# Altium project ZLS-018 Rev 5.PrjPcb
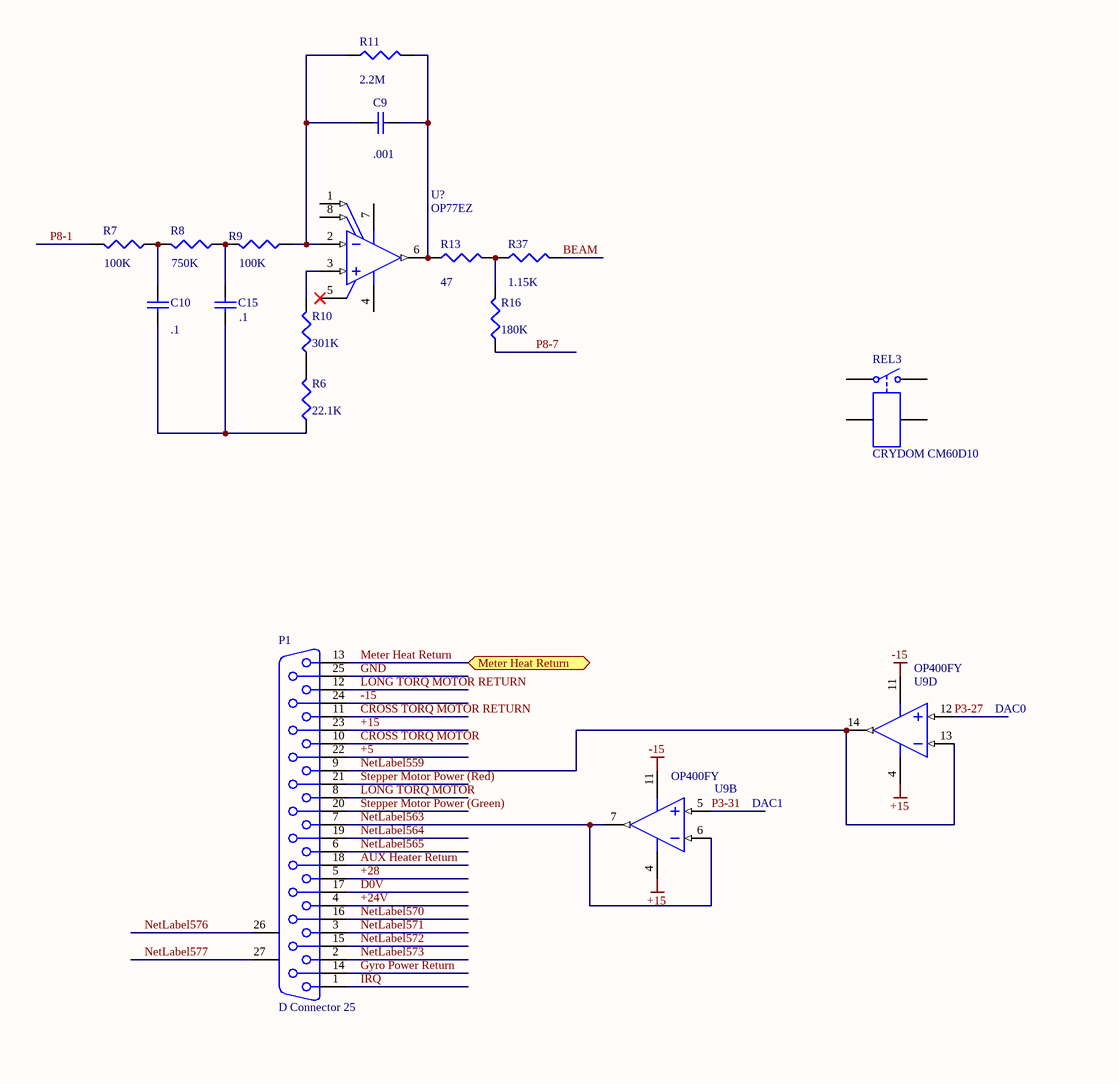
[diagram p0: ZLS-018 Rev 5.SchDoc, top left]
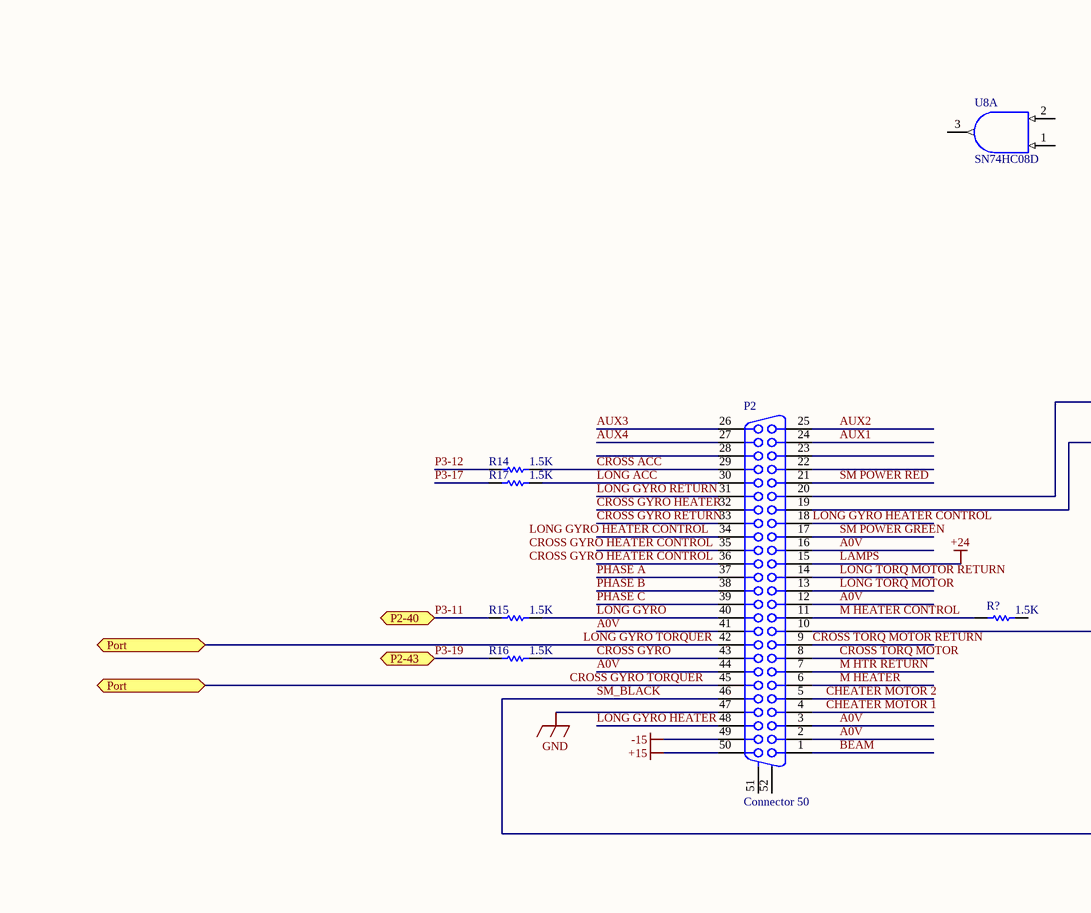
[diagram p1: ZLS-018 Rev 5.SchDoc, bottom left]
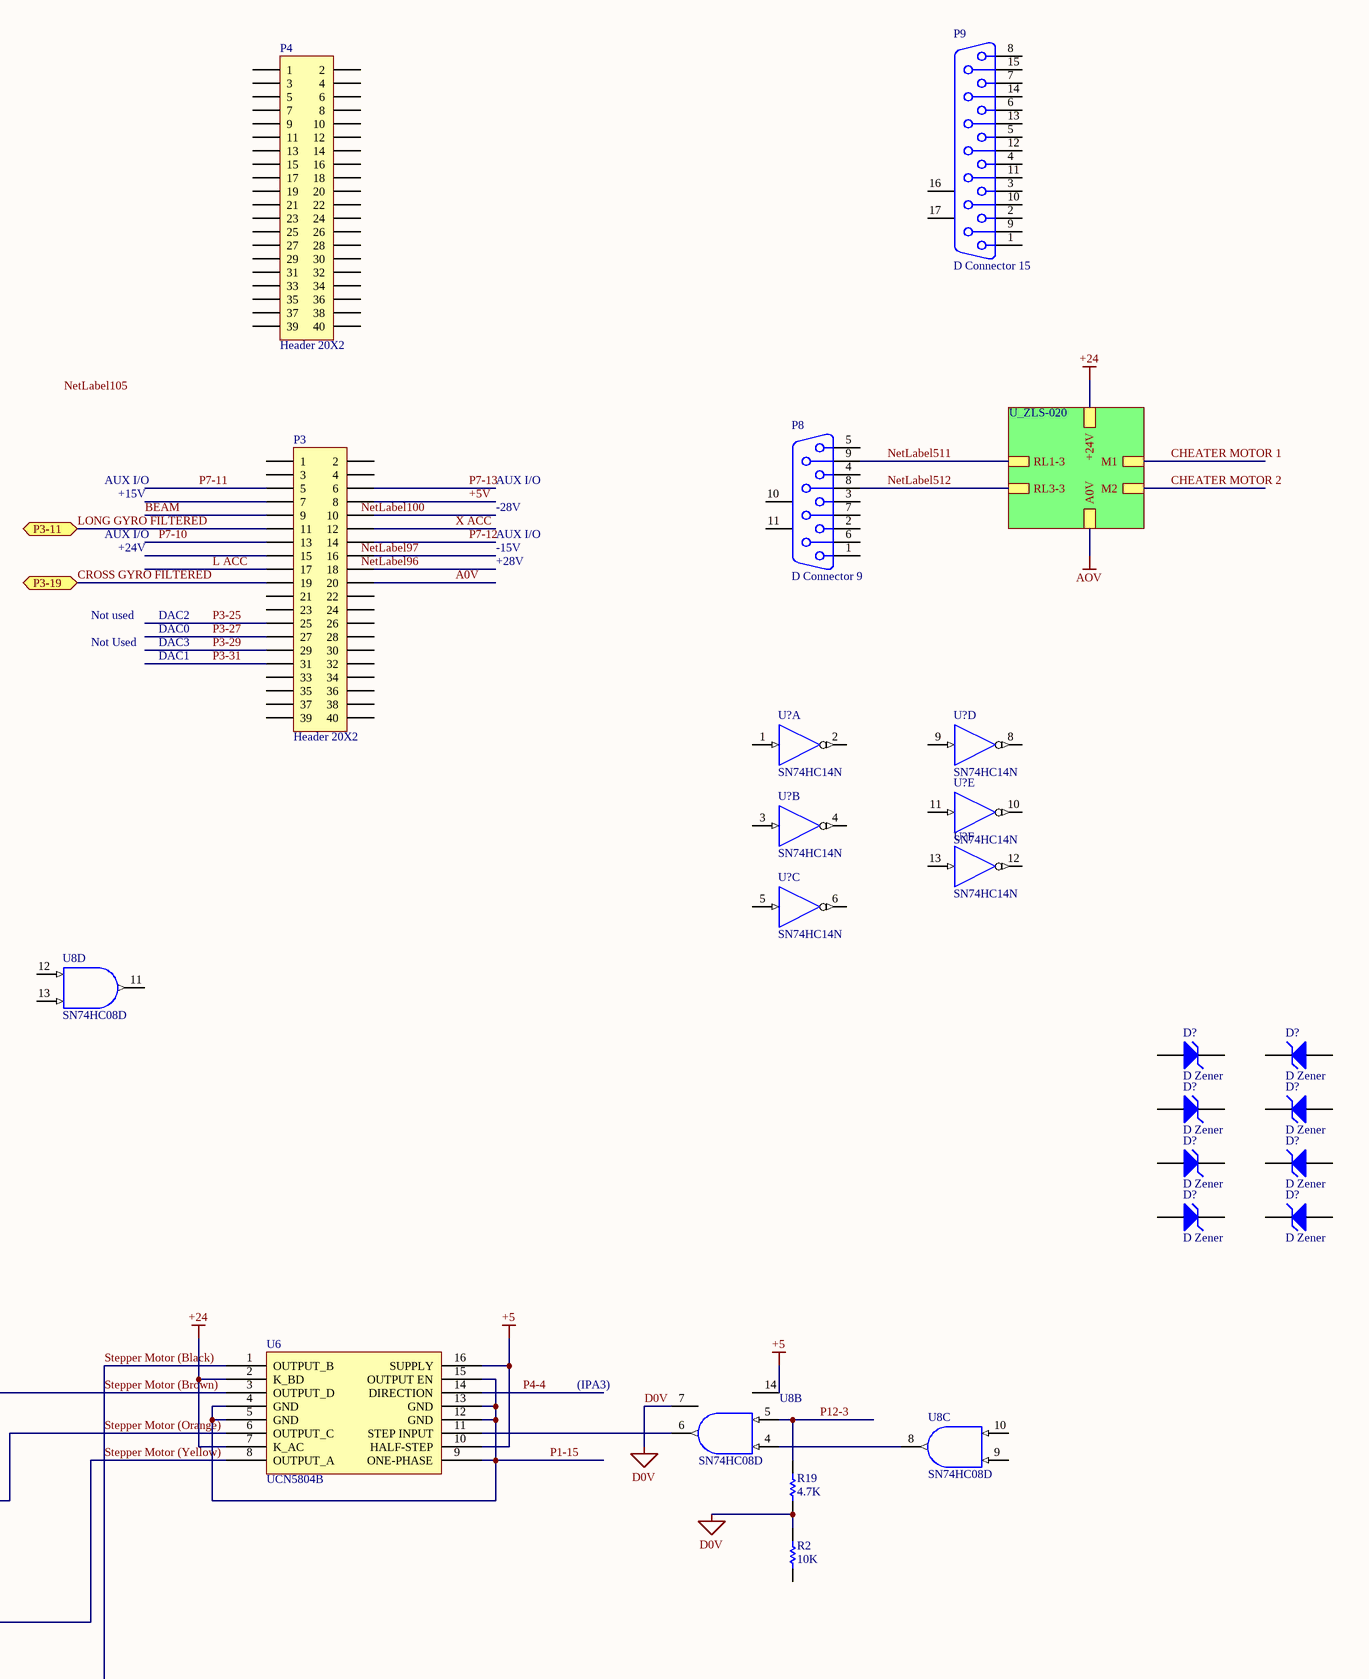
[diagram p2: ZLS-018 Rev 5.SchDoc, bottom right]
6 sheets, 75 parts. Net scope: hierarchical (ports join the sheet entries above them; power ports are global).
Sheets:
  ZLS-018 Rev 5.SchDoc
    U_ZLS-020 = ZLS-020.SchDoc
  ZLS-017.SchDoc
  ZLS-026.SchDoc
  Antialiasing Filter.SchDoc
  Cheater Motor Driver.SchDoc

## Sheet ZLS-018 Rev 5.SchDoc
size OrCAD C

### Parts
(Parts that share a designator on the sheet are numbered #1, #2 ... from top to bottom, then left to right.)
C9  value .001  [RAD-0.3]  (hidden comment: Cap)
C10  value .1  [RAD-0.3]  (hidden comment: Cap)
C15  value .1  [RAD-0.3]  (hidden comment: Cap)
D?#1  D Zener  [DIODE-0.7]
D?#2  D Zener  [DIODE-0.7]
D?#3  D Zener  [DIODE-0.7]
D?#4  D Zener  [DIODE-0.7]
D?#5  D Zener  [DIODE-0.7]
D?#6  D Zener  [DIODE-0.7]
D?#7  D Zener  [DIODE-0.7]
D?#8  D Zener  [DIODE-0.7]
P1  D Connector 25  [DSUB1.385-2H25A]
P2  Connector 50  [CHAMP1.27-2H50]
P3  Header 20X2  [HDR2X20]
P4  Header 20X2  [HDR2X20]
P8  D Connector 9  [DSUB1.385-2H9]
P9  D Connector 15  [DSUB1.385-2H15]
R2  value 10K  [AXIAL-0.3]  (hidden comment: Res1)
R6  value 22.1K  [J1-0603]  (hidden comment: Res3)
R7  value 100K  [J1-0603]  (hidden comment: Res3)
R8  value 750K  [J1-0603]  (hidden comment: Res3)
R9  value 100K  [J1-0603]  (hidden comment: Res3)
R10  value 301K  [J1-0603]  (hidden comment: Res3)
R11  value 2.2M  [J1-0603]  (hidden comment: Res3)
R13  value 47  [J1-0603]  (hidden comment: Res3)
R14  value 1.5K  [AXIAL-0.3]  (hidden comment: Res1)
R15  value 1.5K  [AXIAL-0.3]  (hidden comment: Res1)
R16#1  value 180K  [J1-0603]  (hidden comment: Res3)
R16#2  value 1.5K  [AXIAL-0.3]  (hidden comment: Res1)
R17  value 1.5K  [AXIAL-0.3]  (hidden comment: Res1)
R19#1  value 4.7K  [AXIAL-0.3]  (hidden comment: Res1)
R37  value 1.15K  [J1-0603]  (hidden comment: Res3)
R?#1  value 1.5K  [AXIAL-0.3]  (hidden comment: Res1)
REL3#1  CRYDOM CM60D10  [MODULE4]
U6  UCN5804B
U8  SN74HC08D  [D014_N]  (parts A,B,C,D of 4)
U9  OP400FY  [ADI-Q-14]  (parts B,D of 4)
U?#1  OP77EZ  [ADI-Q-8]
U?#2  SN74HC14N  [N014]  (part A of 6)
U?#3  SN74HC14N  [N014]  (part D of 6)
U?#4  SN74HC14N  [N014]  (part E of 6)
U?#5  SN74HC14N  [N014]  (part B of 6)
U?#6  SN74HC14N  [N014]  (part F of 6)
U?#7  SN74HC14N  [N014]  (part C of 6)

### Sub-sheets
U_ZLS-020 = ZLS-020.SchDoc: +24V, RL1-3, RL3-3, A0V, M2, M1

### Ports
Meter Heat Return, P2-40, P2-43, P3-11, P3-19, Port

### Nets
+5: P1.22 U6.10(HALF-STEP) U6.16(SUPPLY) U8.14(VCC) U?#2.14(VCC) U?#3.14(VCC) U?#4.14(VCC) U?#5.14(VCC) U?#6.14(VCC) U?#7.14(VCC)  [also labelled VCC]
+15: P1.23 P2.50 U9.4(+V)
-15: P1.24 P2.49 U9.11(-V)
D0V: P1.17 P1.25 P2.47 R2.2 R19#1.1 U8.7(GND) U?#2.7(GND) U?#3.7(GND) U?#4.7(GND) U?#5.7(GND) U?#6.7(GND) U?#7.7(GND)  [also labelled GND]
LAMPS: P2.15 U6.2(K_BD) U6.7(K_AC) ; sheet U_ZLS-020/+24V  [also labelled +24]
+5V: P3.8
+24V: P1.4
+28: P1.5
A0V: P2.2 P2.3 P2.12 P2.16 P2.41 P2.44 P3.20
AUX1: P2.24
AUX2: P2.25
AUX3: P2.26
AUX4: P2.27
AUX Heater Return: P1.18
BEAM: P2.1 P3.9 R37.2
CHEATER MOTOR 1: P2.4 ; sheet U_ZLS-020/M1
CHEATER MOTOR 2: P2.5 ; sheet U_ZLS-020/M2
CROSS ACC: P2.29 R14.2
CROSS GYRO: P2.43 R16#2.2
CROSS GYRO FILTERED: P3.19 ; port P3-19
CROSS GYRO HEATER: P2.32
CROSS GYRO RETURN: P2.33
CROSS GYRO TORQUER: P2.42 P2.45 ; port Port  [also labelled LONG GYRO TORQUER]
CROSS TORQ MOTOR: P1.10 P2.8
CROSS TORQ MOTOR RETURN: P1.11 P2.9
Gyro Power Return: P1.14
IRQ: P1.1
L ACC: P3.17
LONG ACC: P2.30 R17.2
LONG GYRO: P2.40 R15.2
LONG GYRO FILTERED: P3.11 ; port P3-11
LONG GYRO HEATER: P2.48
LONG GYRO HEATER CONTROL: P2.18
LONG GYRO RETURN: P2.31
LONG TORQ MOTOR: P1.8 P2.13
LONG TORQ MOTOR RETURN: P1.12 P2.14
M HEATER: P2.6
M HEATER CONTROL: P2.11 R?#1.1
M HTR RETURN: P2.7
Meter Heat Return: P1.13 ; port Meter Heat Return
NetLabel511: P8.9 ; sheet U_ZLS-020/RL1-3
NetLabel512: P8.8 ; sheet U_ZLS-020/RL3-3
NetLabel559: P1.9 U9.13(-IN_D) U9.14(OUT_D)
NetLabel563: P1.7 U9.6(-IN_B) U9.7(OUT_B)
NetLabel564: P1.19
NetLabel565: P1.6
NetLabel570: P1.16
NetLabel571: P1.3
NetLabel572: P1.15
NetLabel573: P1.2
NetLabel576: P1.26(MH1)
NetLabel577: P1.27(MH2)
P1-15: U6.4(GND) U6.5(GND) U6.9(ONE-PHASE) U6.12(GND) U6.13(GND) U6.15(OUTPUT_EN)
P3-11: R15.1 ; port P2-40
P3-12: R14.1
P3-17: R17.1
P3-19: R16#2.1 ; port P2-43
P3-25: P3.25
P3-27: P3.27 U9.12(+IN_D)
P3-29: P3.29
P3-31: P3.31 U9.5(+IN_B)
P4-4: U6.14(DIRECTION)
P7-10: P3.13
P7-11: P3.5
P7-12: P3.14
P7-13: P3.6
P8-1: R7.2
P8-7: R16#1.1
P12-3: R19#1.2 U8.5(B)
PHASE A: P2.37
PHASE B: P2.38
PHASE C: P2.39
SM POWER GREEN: P2.17
SM POWER RED: P2.21
SM_BLACK: P2.10 P2.19 P2.20 P2.46 U6.1(OUTPUT_B) U6.3(OUTPUT_D) U6.6(OUTPUT_C) U6.8(OUTPUT_A)  [also labelled Stepper Motor (Black), Stepper Motor (Brown), Stepper Motor (Orange), Stepper Motor (Yellow)]
Stepper Motor Power (Green): P1.20
Stepper Motor Power (Red): P1.21
X ACC: P3.12
NetC9_1: C9.1 R9.1 R11.1 U?#1.2(-IN)
NetC9_2: C9.2 R11.2 R13.1 U?#1.6(OUT)
NetC10_1: C10.1 C15.1 R6.1
NetC10_2: C10.2 R7.1 R8.2
NetC15_2: C15.2 R8.1 R9.2
NetR6_2: R6.2 R10.1
NetR10_2: R10.2 U?#1.3(+IN)
NetR13_2: R13.2 R16#1.2 R37.1
NetU6_11: U6.11(STEP_INPUT) U8.6(Y)
NetU8_4: U8.4(A) U8.8(Y)

Not connected (* = marked no-connect by the designer): D?#1 1(A) 2(K); D?#2 1(A) 2(K); D?#3 1(A) 2(K); D?#4 1(A) 2(K); D?#5 1(A) 2(K); D?#6 1(A) 2(K); D?#7 1(A) 2(K); D?#8 1(A) 2(K); P2 22 23 28 34 35 36 51(MH1) 52(MH2); P3 1 2 3 4 7 10 15 16 18 21 22 23 24 26 28 30 32 33 34 35 36 37 38 39 40; P4 1 2 3 4 5 6 7 8 9 10 11 12 13 14 15 16 17 18 19 20 21 22 23 24 25 26 27 28 29 30 31 32 33 34 35 36 37 38 39 40; P8 1 2 3 4 5 6 7 10(MH1) 11(MH2); P9 1 2 3 4 5 6 7 8 9 10 11 12 13 14 15 16(MH1) 17(MH2); R2 1; R?#1 2; REL3#1 1 2 3 4; U8 1(A) 2(B) 3(Y) 9(A) 10(B) 11(Y) 12(A) 13(B); U?#1 1(VOS_TRIM) 4(V-) 5(NC)* 7(V+) 8(VOS_TRIM); U?#2 1(A) 2(Y); U?#3 8(Y) 9(A); U?#4 10(Y) 11(A); U?#5 3(A) 4(Y); U?#6 12(Y) 13(A); U?#7 5(A) 6(Y)

### Notes on the sheet
- AUX I/O
- +15V
- -28V
- DAC0
- +24V
- +28V
- -15V
- DAC1
- Not used
- Not Used
- DAC3
- DAC2
- (IPA3)
- Labels drawn without touching a wire or pin: CROSS GYRO HEATER CONTROL, LONG GYRO HEATER CONTROL, NetLabel96, NetLabel97, NetLabel100, NetLabel105
- Title
- Size:
- Date:
- File:
- Orcad C
- Number:
- Time:
- Revision:
- Sheet
- of

### Library data of the parts
C9 C10 C15 = Cap: Capacitor; Published: 8-Jun-2000; LatestRevisionDate: 17-Jul-2002; LatestRevisionNote: Re-released for DXP Platform.; PackageReference: RAD-0.3; Publisher: Altium Limited; PackageDescription: Radial Cap, Thru-Hole; 2 Leads; 0.3 in Pin Spacing
D?#1-D?#8 = D Zener: Zener Diode; Published: 8-Jun-2000; LatestRevisionDate: 17-Jul-2002; LatestRevisionNote: Re-released for DXP Platform.; PackageReference: DIODE-0.7; Publisher: Altium Limited; PackageDescription: Diode, Thru-Hole; 2 Leads; 0.7 in Pin Spacing
P1 = D Connector 25: Receptacle Assembly, 25 Position, Right Angle; PackageDocument: U; Positions: 25; Published: 15-Jun-2001; LatestRevisionDate: 17-Jul-2002; LatestRevisionNote: Re-released for DXP Platform.; DatasheetDocument: 19-Mar-1999; PackageReference: 787202; Publisher: Altium Limited; Orientation: Right Angle; Gender: Receptacle
P2 = Connector 50: Receptacle Header Assemby; PackageDocument: B; Positions: 50; Published: 15-Jun-2001; LatestRevisionDate: 17-Jul-2002; LatestRevisionNote: Re-released for DXP Platform.; DatasheetDocument: 1-Oct-1983; PackageReference: 178240-7; Publisher: Altium Limited; Orientation: Right Angle
P3 P4 = Header 20X2: Header, 20-Pin, Dual row; LatestRevisionDate: 17-Jul-2002; LatestRevisionNote: Re-released for DXP Platform.; Publisher: Altium Limited
P8 = D Connector 9: Receptacle Assembly, 9 Position, Right Angle; PackageDocument: O; Positions: 9; Published: 15-Jun-2001; LatestRevisionDate: 17-Jul-2002; LatestRevisionNote: Re-released for DXP Platform.; DatasheetDocument: 1-Sep-1999; PackageReference: 788750; Publisher: Altium Limited; Orientation: Right Angle; Gender: Receptacle
P9 = D Connector 15: Receptacle Assembly, 15 Position, Right Angle; PackageDocument: O; Positions: 15; Published: 15-Jun-2001; LatestRevisionDate: 17-Jul-2002; LatestRevisionNote: Re-released for DXP Platform.; DatasheetDocument: 1-Sep-99; PackageReference: 788757; Publisher: Altium Limited; Orientation: Right Angle; Gender: Receptacle
R2 R14 R15 R16#2 R17 R19#1 R?#1 = Res1: Resistor; Published: 8-Jun-2000; LatestRevisionDate: 17-Jul-2002; LatestRevisionNote: Re-released for DXP Platform.; PackageReference: AXIAL-0.3; Publisher: Altium Limited; PackageDescription: Axial Device, Thru-Hole; 2 Leads; 0.3 in Pin Spacing
R6-R11 R13 R16#1 R37 = Res3: Resistor; Published: 8-Jun-2000; LatestRevisionDate: 29-May-2009; LatestRevisionNote: IPC-7351 Footprint Added.; PackageReference: J1-0603; Publisher: Altium Limited; PackageDescription: Chip Resistor
REL3#1 = Relay-SPST: Single-Pole Single-Throw Relay; Published: 24-Mar-1999; LatestRevisionDate: 17-Jul-2002; LatestRevisionNote: Re-released for DXP Platform.; PackageReference: MODULE4; Publisher: Altium Limited
U8 = SN74HC08D: Quadruple 2-Input Positive-AND Gate; Published: 8-Jun-2000; LatestRevisionDate: 13-Apr-2006; LatestRevisionNote: IPC-7351 Footprint Added.; DatasheetVersion: May-1997; PackageVersion: Jan-1998; PackageReference: D014; Publisher: Altium Limited; PackageDescription: 14-Pin Small Outline Integrated Circuit 1.27 mm Pitch; Code_IPC: SOIC127P600-14; ComponentLink1Description: Manufacturer Link; ComponentLink1URL: http://www.ti.com/; ComponentLink2Description: Datasheet; ComponentLink2URL: http://www-s.ti.com/sc/ds/SN74HC08.pdf
U9 = CMP-0384-00277-1: Quad Channel Low Supply Current Operational Amplifier, 500 KHz BW, 150 mV/us SR, Industrial, 14-pin DIP (Q-14), Tube; Manufacturer: Analog Devices; Generic Part Number: OP400; Small Signal Bandwidth: 500KHz; Input Bias Current: 750pA; Input Offset Voltage: 80uV; Iq/Amp: 725uA; V Span Max: 40V; Amplifiers Per Package: 4; V Span Min: 6V; Packing: Tube; Mounting Technology: Through Hole; ComponentLink3Description: Package Specification; Slew Rate: 150mV/us; ComponentLink2Description: Datasheet; ComponentLink1Description: Manufacturer URL; ComponentLink1URL: http://www.analog.com/en/index.html; PackageDescription: 14-Pin Ceramic Dual In-Line Package, Row spacing 7.62 mm, Pitch 2.54 mm; ComponentLink2URL: http://www.analog.com/static/imported-files/data_sheets/OP400.pdf; DatasheetVersion: Rev. G; PackageReference: Q-14; PartNumber: OP400FY; ComponentLink3URL: http://www.analog.com/static/imported-files/packages/393665681442905251546090Q_14.pdf
U?#1 = CMP-0384-00323-1: Single Channel Ultra High Gain Operational Amplifier, 600 KHz BW, 300 mV/us SR, Industrial, 8-pin DIP (Q-8), Tube; Generic Part Number: OP77; Manufacturer: Analog Devices; Iq/Amp: 2mA; Small Signal Bandwidth: 600KHz; V Span Max: 44V; Input Bias Current: 1.2nA; Amplifiers Per Package: 1; Input Offset Voltage: 10uV; V Span Min: 6V; ComponentLink2Description: Datasheet; ComponentLink3URL: http://www.analog.com/static/imported-files/packages/3925655241313314758Q_8.pdf; PartNumber: OP77EZ; ComponentLink2URL: http://www.analog.com/static/imported-files/data_sheets/OP77.pdf; PackageDescription: 8-Pin Ceramic Dual In-Line Package, Row spacing 7.62 mm, Pitch 2.54 mm; PackageReference: Q-8; ComponentLink1Description: Manufacturer URL; Mounting Technology: Through Hole; ComponentLink3Description: Package Specification; ComponentLink1URL: http://www.analog.com/en/index.html; Slew Rate: 300mV/us; DatasheetVersion: Rev. E; Packing: Tube
U?#2-U?#7 = SN74HC14N: Hex Schmitt-Trigger Inverter; Published: 8-Jun-2000; LatestRevisionDate: 04-Mar-2005; LatestRevisionNote: Stylized 3D Model Added.; DatasheetVersion: May-1997; PackageVersion: Oct-1995; PackageReference: N014; Publisher: Altium Limited; PackageDescription: DIP; 14 Leads; Row Spacing 7.62 mm; Pitch 2.54 mm; ComponentLink1Description: Manufacturer Link; ComponentLink1URL: http://www.ti.com/; ComponentLink2Description: Datasheet; ComponentLink2URL: http://www-s.ti.com/sc/ds/sn74hc14.pdf

## Sheet ZLS-020.SchDoc: ZLS-020
size OrCAD A; Revision: 1; SheetNumber: 1; SheetTotal: 1; DocumentName: ZLS-020; ProjectName: ZLS-020
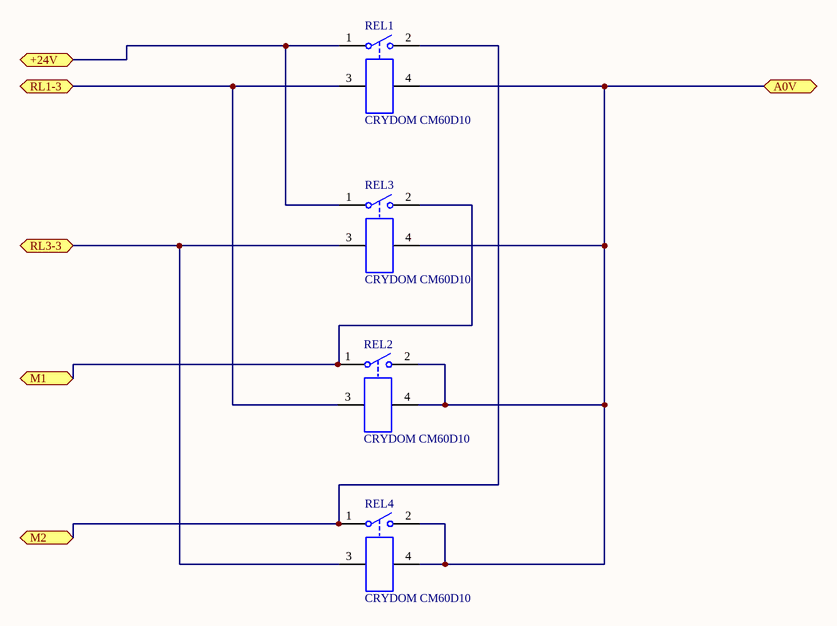
[diagram p3: ZLS-020.SchDoc]

### Parts
(Parts that share a designator on the sheet are numbered #1, #2 ... from top to bottom, then left to right.)
REL1  CRYDOM CM60D10  [MODULE4]
REL2  CRYDOM CM60D10  [MODULE4]
REL3#2  CRYDOM CM60D10  [MODULE4]
REL4  CRYDOM CM60D10  [MODULE4]

### Ports
+24V, A0V, M1, M2, RL1-3, RL3-3

### Nets
AOV: REL1.4 REL2.2 REL2.4 REL3#2.4 REL4.2 REL4.4 ; port A0V
LAMPS: REL1.1 REL3#2.1 ; port +24V
CHEATER MOTOR 1: REL2.1 REL3#2.2 ; port M1
CHEATER MOTOR 2: REL1.2 REL4.1 ; port M2
NetLabel511: REL1.3 REL2.3 ; port RL1-3
NetLabel512: REL3#2.3 REL4.3 ; port RL3-3

### Notes on the sheet
- Title
- Size:
- Date:
- Orcad A
- Number:
- Time:
- Revision:
- Sheet
- of
- ZLS Corporation
- 7801 North Lamar Blvd
- Suite E-184
- Austin, TX  78752
- Phone: (512) 453-0288
- File:

### Library data of the parts
REL1 REL2 REL3#2 REL4 = Relay-SPST: Single-Pole Single-Throw Relay; Published: 24-Mar-1999; LatestRevisionDate: 17-Jul-2002; LatestRevisionNote: Re-released for DXP Platform.; PackageReference: MODULE4; Publisher: Altium Limited

## Sheet ZLS-017.SchDoc: ZLS-017
size OrCAD A
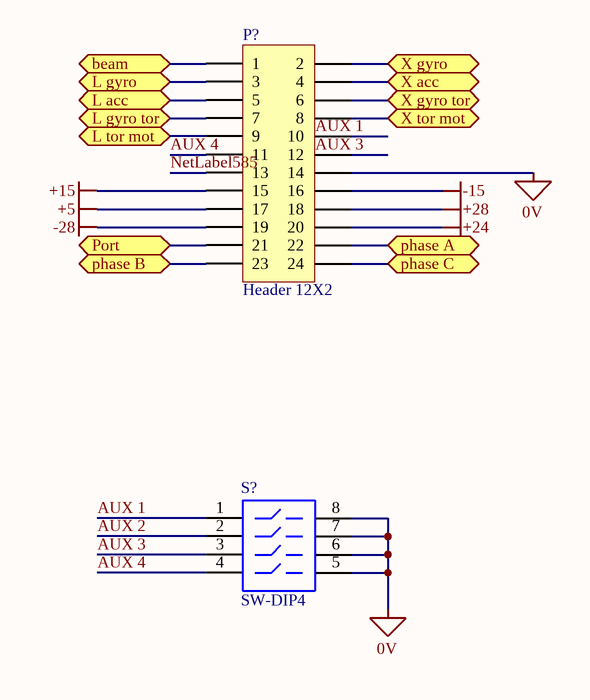
[diagram p4: ZLS-017.SchDoc]

### Parts
P?  Header 12X2  [HDR2X12]
S?  SW-DIP4  [DIP-8]

### Ports
beam, L acc, L gyro, L gyro tor, L tor mot, phase A, phase B, phase C, Port, X acc, X gyro, X gyro tor, X tor mot

### Nets
0V: P?.14 S?.5 S?.6 S?.7 S?.8
+5: P?.17
+15: P?.15
+24: P?.20  [project net LAMPS]
+28: P?.18
-15: P?.16
-28: P?.19
AUX 1: S?.1
AUX 2: S?.2
AUX 3: S?.3
AUX 4: P?.11 S?.4
NetLabel585: P?.13
NetP?_1: P?.1 ; port beam
NetP?_2: P?.2 ; port X gyro
NetP?_3: P?.3 ; port L gyro
NetP?_4: P?.4 ; port X acc
NetP?_5: P?.5 ; port L acc
NetP?_6: P?.6 ; port X gyro tor
NetP?_7: P?.7 ; port L gyro tor
NetP?_8: P?.8 ; port X tor mot
NetP?_9: P?.9 ; port L tor mot
NetP?_21: P?.21 ; port Port
NetP?_22: P?.22 ; port phase A
NetP?_23: P?.23 ; port phase B
NetP?_24: P?.24 ; port phase C

Not connected (* = marked no-connect by the designer): P? 10 12

### Notes on the sheet
- Labels drawn without touching a wire or pin: AUX 1, AUX 3
- Title
- Size:
- Date:
- Orcad A
- Number:
- Time:
- Revision:
- Sheet
- of
- ZLS Corporation
- 7801 North Lamar Blvd
- Suite E-184
- Austin, TX  78752
- Phone: (512) 453-0288
- File:

### Library data of the parts
P? = Header 12X2: Header, 12-Pin, Dual row; LatestRevisionDate: 17-Jul-2002; LatestRevisionNote: Re-released for DXP Platform.; Publisher: Altium Limited
S? = SW-DIP4: DIP Switch; Published: 24-Mar-1999; LatestRevisionDate: 17-Jul-2002; LatestRevisionNote: Re-released for DXP Platform.; PackageReference: DIP-8; Publisher: Altium Limited

## Sheet ZLS-026.SchDoc
size Tabloid
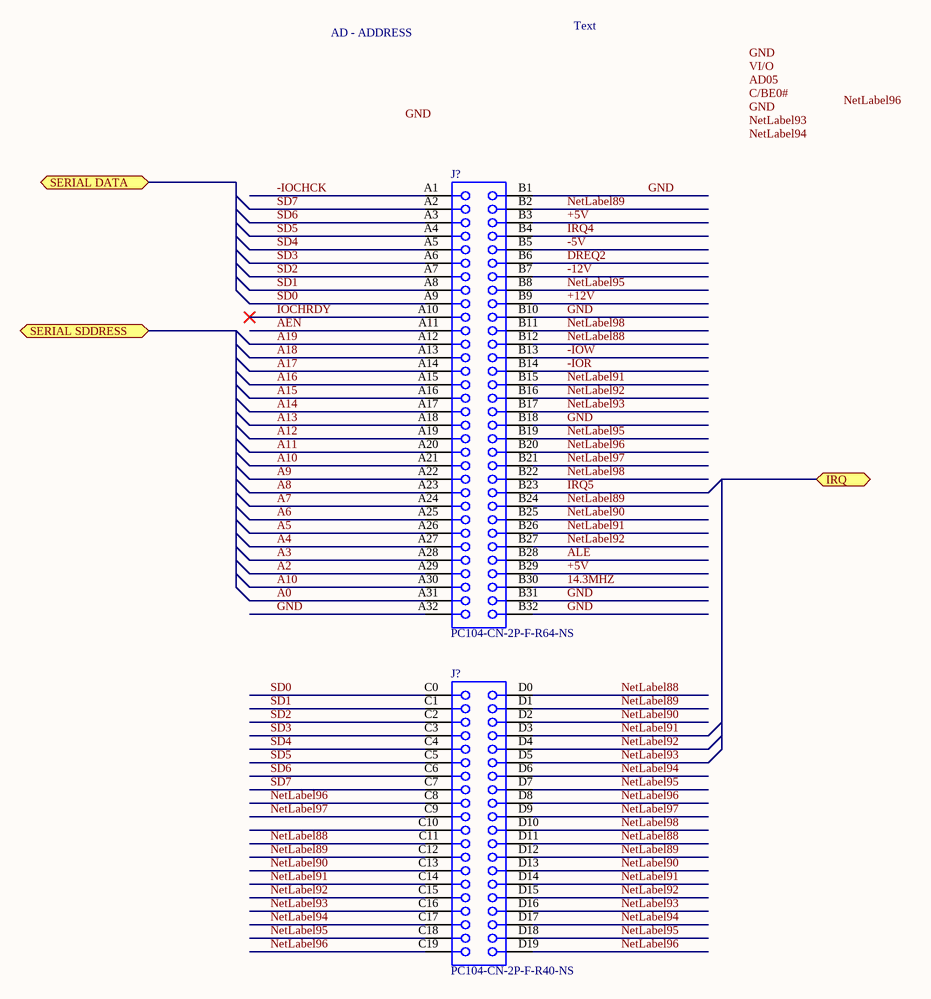
[diagram p5: ZLS-026.SchDoc]

### Parts
(Parts that share a designator on the sheet are numbered #1, #2 ... from top to bottom, then left to right.)
J?#1  PC104-CN-2P-F-R64-NS  [BTB2-54-V64F-03]
J?#2  PC104-CN-2P-F-R40-NS  [BTB2-54-V40F-03]

### Ports
IRQ, SERIAL DATA, SERIAL SDDRESS

### Nets
14.3MHZ: J?#1.B30
+5V: J?#1.B3 J?#1.B29
+12V: J?#1.B9
-5V: J?#1.B5
-12V: J?#1.B7
-IOCHCK: J?#1.A1
-IOR: J?#1.B14
-IOW: J?#1.B13
A0: J?#1.A31
A2: J?#1.A29
A3: J?#1.A28
A4: J?#1.A27
A5: J?#1.A26
A6: J?#1.A25
A7: J?#1.A24
A8: J?#1.A23
A9: J?#1.A22
A10: J?#1.A21 J?#1.A30
A11: J?#1.A20
A12: J?#1.A19
A13: J?#1.A18
A14: J?#1.A17
A15: J?#1.A16
A16: J?#1.A15
A17: J?#1.A14
A18: J?#1.A13
A19: J?#1.A12
AEN: J?#1.A11
ALE: J?#1.B28
DREQ2: J?#1.B6
GND: J?#1.A32 J?#1.B1 J?#1.B10 J?#1.B18 J?#1.B31 J?#1.B32
IOCHRDY: J?#1.A10
IRQ4: J?#1.B4
IRQ5: J?#1.B23
NetLabel88: J?#1.B12 J?#2.C11 J?#2.D0 J?#2.D11
NetLabel89: J?#1.B2 J?#1.B24 J?#2.C12 J?#2.D1 J?#2.D12
NetLabel90: J?#1.B25 J?#2.C13 J?#2.D2 J?#2.D13
NetLabel91: J?#1.B15 J?#1.B26 J?#2.C14 J?#2.D3 J?#2.D14
NetLabel92: J?#1.B16 J?#1.B27 J?#2.C15 J?#2.D4 J?#2.D15
NetLabel93: J?#1.B17 J?#2.C16 J?#2.D5 J?#2.D16
NetLabel94: J?#2.C17 J?#2.D6 J?#2.D17
NetLabel95: J?#1.B8 J?#1.B19 J?#2.C18 J?#2.D7 J?#2.D18
NetLabel96: J?#1.B20 J?#2.C8 J?#2.C19 J?#2.D8 J?#2.D19
NetLabel97: J?#1.B21 J?#2.C9 J?#2.D9
NetLabel98: J?#1.B11 J?#1.B22 J?#2.D10
SD0: J?#1.A9 J?#2.C0
SD1: J?#1.A8 J?#2.C1
SD2: J?#1.A7 J?#2.C2
SD3: J?#1.A6 J?#2.C3
SD4: J?#1.A5 J?#2.C4
SD5: J?#1.A4 J?#2.C5
SD6: J?#1.A3 J?#2.C6
SD7: J?#1.A2 J?#2.C7

Not connected (* = marked no-connect by the designer): J?#2 C10(31)

### Notes on the sheet
- AD - ADDRESS
- Text
- Labels drawn without touching a wire or pin: AD05, C/BE0#, GND, NetLabel93, NetLabel94, NetLabel96, VI/O
- Title
- Size:
- Date:
- Tabloid
- Number:
- Time:
- Revision:
- Sheet
- of
- ZLS Corporation
- 7801 North Lamar Blvd.
- Suite E-184
- Austin, Texas 78752  USA
- (512) 453-0288
- File:

### Library data of the parts
J?#1 = CMP-0001-00109-1: Board-to-Board Connector,  PC104 BA ISA, Vertical, 2-Row, 64-Postion, Pitch 2.54mm, Receptacle; Mating Connector: Harwin-M20-6113205 (Non-stackthrough); ClassName: Board Template Connector; Publisher: Altium; Package Reference: BTB2-54-V64F-03; Component Kind: Standard
J?#2 = CMP-0001-00108-1: Board-to-Board Connector,  PC104 CD ISA, Vertical, 2-Row, 40-Postion, Pitch 2.54mm, Receptacle; Mating Connector: Harwin-M20-6112005 (Non-stackthrough); Package Reference: BTB2-54-V40F-03; Component Kind: Standard; ClassName: Board Template Connector; Publisher: Altium

## Sheet Antialiasing Filter.SchDoc: Anti-aliasing Filter
size OrCAD A
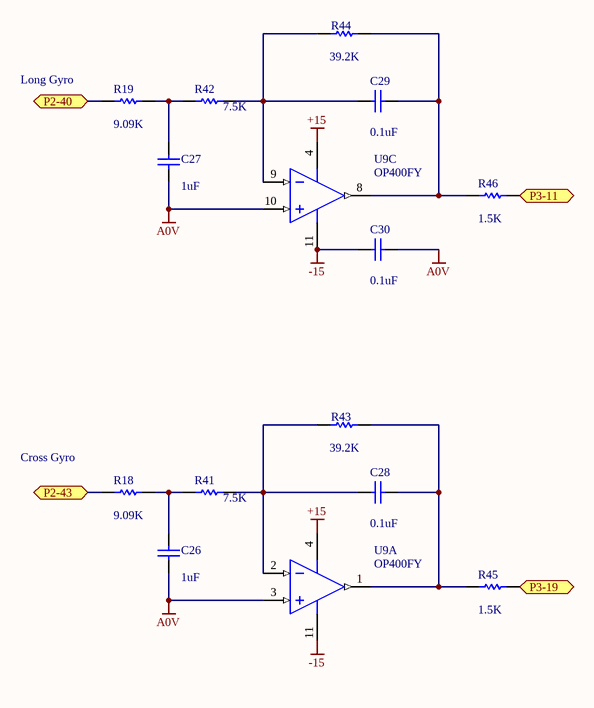
[diagram p6: Antialiasing Filter.SchDoc]

### Parts
(Parts that share a designator on the sheet are numbered #1, #2 ... from top to bottom, then left to right.)
C26  value 1uF  [RAD-0.3]  (hidden comment: Cap)
C27  value 1uF  [RAD-0.3]  (hidden comment: Cap)
C28  value 0.1uF  [RAD-0.3]  (hidden comment: Cap)
C29  value 0.1uF  [RAD-0.3]  (hidden comment: Cap)
C30  value 0.1uF  [RAD-0.3]  (hidden comment: Cap)
R18  value 9.09K  [AXIAL-0.3]  (hidden comment: Res1)
R19#2  value 9.09K  [AXIAL-0.3]  (hidden comment: Res1)
R41  value 7.5K  [AXIAL-0.3]  (hidden comment: Res1)
R42  value 7.5K  [AXIAL-0.3]  (hidden comment: Res1)
R43  value 39.2K  [AXIAL-0.3]  (hidden comment: Res1)
R44  value 39.2K  [AXIAL-0.3]  (hidden comment: Res1)
R45  value 1.5K  [AXIAL-0.3]  (hidden comment: Res1)
R46  value 1.5K  [AXIAL-0.3]  (hidden comment: Res1)
U9  OP400FY  [ADI-Q-14]  (parts A,C of 4)

### Ports
P2-40, P2-43, P3-11, P3-19

### Nets
+15: U9.4(+V)
-15: C30.1 U9.11(-V)
A0V: C26.2 C27.2 C30.2 U9.3(+IN_A) U9.10(+IN_C)
NetC26_1: C26.1 R18.2 R41.1
NetC27_1: C27.1 R19#2.2 R42.1
NetC28_1: C28.1 R41.2 R43.1 U9.2(-IN_A)
NetC28_2: C28.2 R43.2 R45.1 U9.1(OUT_A)
NetC29_1: C29.1 R42.2 R44.1 U9.9(-IN_C)
NetC29_2: C29.2 R44.2 R46.1 U9.8(OUT_C)
NetR18_1: R18.1 ; port P2-43
NetR19#2_1: R19#2.1 ; port P2-40
NetR45_2: R45.2 ; port P3-19
NetR46_2: R46.2 ; port P3-11

### Notes on the sheet
- (near R19#2) Long Gyro
- (near R18) Cross Gyro
- Title
- Size:
- Date:
- Orcad A
- Number:
- Time:
- Revision:
- Sheet
- of
- ZLS Corporation
- 7801 North Lamar Blvd.
- Suite E-184
- Austin, Texas 78752  USA
- (512) 453-0288
- File:

### Library data of the parts
C26-C30 = Cap: Capacitor; Published: 8-Jun-2000; LatestRevisionDate: 17-Jul-2002; LatestRevisionNote: Re-released for DXP Platform.; PackageReference: RAD-0.3; Publisher: Altium Limited; PackageDescription: Radial Cap, Thru-Hole; 2 Leads; 0.3 in Pin Spacing
R18 R19#2 R41-R46 = Res1: Resistor; Published: 8-Jun-2000; LatestRevisionDate: 17-Jul-2002; LatestRevisionNote: Re-released for DXP Platform.; PackageReference: AXIAL-0.3; Publisher: Altium Limited; PackageDescription: Axial Device, Thru-Hole; 2 Leads; 0.3 in Pin Spacing
U9 = CMP-0384-00277-1: as U9 on sheet ZLS-018 Rev 5; Packing: Tube; Mounting Technology: Through Hole; ComponentLink3Description: Package Specification; Slew Rate: 150mV/us; ComponentLink2Description: Datasheet; ComponentLink1Description: Manufacturer URL; ComponentLink1URL: http://www.analog.com/en/index.html; PackageDescription: 14-Pin Ceramic Dual In-Line Package, Row spacing 7.62 mm, Pitch 2.54 mm; ComponentLink2URL: http://www.analog.com/static/imported-files/data_sheets/OP400.pdf; DatasheetVersion: Rev. G; PackageReference: Q-14; PartNumber: OP400FY; ComponentLink3URL: http://www.analog.com/static/imported-files/packages/393665681442905251546090Q_14.pdf

## Sheet Cheater Motor Driver.SchDoc: Cheater Motor Driver
size OrCAD A; DocumentNumber: ZLS-018; Revision: A; SheetNumber: 3; SheetTotal: 3; ProjectName: ZLS-018
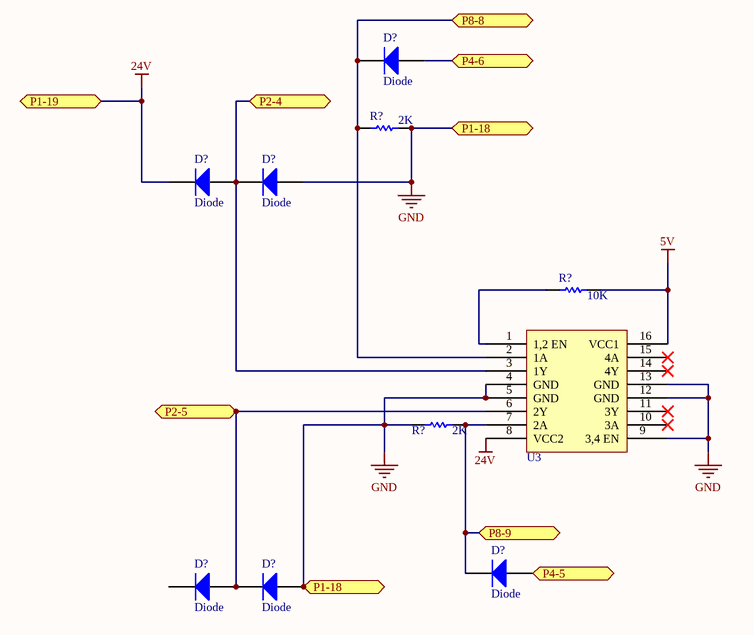
[diagram p7: Cheater Motor Driver.SchDoc]

### Parts
(Parts that share a designator on the sheet are numbered #1, #2 ... from top to bottom, then left to right.)
D?#9  Diode  [SMC]
D?#10  Diode  [SMC]
D?#11  Diode  [SMC]
D?#12  Diode  [SMC]
D?#13  Diode  [SMC]
D?#14  Diode  [SMC]
R?#2  value 2K  [AXIAL-0.3]  (hidden comment: Res1)
R?#3  value 10K  [AXIAL-0.3]  (hidden comment: Res1)
R?#4  value 2K  [AXIAL-0.3]  (hidden comment: Res1)
U3  SN754410  [DIP-16-KEY]  (value not drawn)

### Ports
P1-18, P1-19, P2-4, P2-5, P4-5, P4-6, P8-8, P8-9

### Nets
5V: R?#3.2 U3.16(VCC1)
24V: D?#10.2(K) U3.8(VCC2) ; port P1-19
GND: D?#11.1(A) D?#14.1(A) R?#2.2 R?#4.1 U3.4(GND) U3.5(GND) U3.9(3,4_EN) U3.12(GND) U3.13(GND) ; port P1-18  [project net D0V]
NetD?#9_1: D?#9.1(A) ; port P4-6
NetD?#9_2: D?#9.2(K) R?#2.1 U3.2(1A) ; port P8-8
NetD?#10_1: D?#10.1(A) D?#11.2(K) U3.3(1Y) ; port P2-4
NetD?#12_1: D?#12.1(A) ; port P4-5
NetD?#12_2: D?#12.2(K) R?#4.2 U3.7(2A) ; port P8-9
NetD?#13_1: D?#13.1(A) D?#14.2(K) U3.6(2Y) ; port P2-5
NetR?#3_1: R?#3.1 U3.1(1,2_EN)

Not connected (* = marked no-connect by the designer): D?#13 2(K); U3 10(3A)* 11(3Y)* 14(4Y)* 15(4A)*

### Notes on the sheet
- Title
- Size:
- Date:
- Orcad A
- Number:
- Time:
- Revision:
- Sheet
- of
- ZLS Corporation
- 7801 North Lamar Blvd.
- Suite E-184
- Austin, Texas 78752  USA
- (512) 453-0288
- File:

### Library data of the parts
D?#9-D?#14 = Diode: Default Diode; Published: 8-Jun-2000; LatestRevisionDate: 17-Jul-2002; LatestRevisionNote: Re-released for DXP Platform.; PackageVersion: Sep-1996; PackageReference: SMC; Publisher: Altium Limited; PackageDescription: DO-214-AB/SMC; 2 C-Bend Leads; Body 7.9 x 5.9 mm, inc. leads (LxW); Code_JEDEC: DO-214-AB
R?#2-R?#4 = Res1: Resistor; Published: 8-Jun-2000; LatestRevisionDate: 17-Jul-2002; LatestRevisionNote: Re-released for DXP Platform.; PackageReference: AXIAL-0.3; Publisher: Altium Limited; PackageDescription: Axial Device, Thru-Hole; 2 Leads; 0.3 in Pin Spacing

## Nets that join several sheets
+5: ZLS-018 Rev 5 (10 pins), ZLS-017 (P?.17)
+15: ZLS-018 Rev 5 (P1.23 P2.50 U9.4), ZLS-017 (P?.15), Antialiasing Filter (U9.4)
-15: ZLS-018 Rev 5 (P1.24 P2.49 U9.11), ZLS-017 (P?.16), Antialiasing Filter (C30.1 U9.11)
D0V: ZLS-018 Rev 5 (12 pins), Cheater Motor Driver (9 pins)
LAMPS: ZLS-018 Rev 5 (P2.15 U6.2 U6.7), ZLS-020 (REL1.1 REL3#2.1), ZLS-017 (P?.20)
CHEATER MOTOR 1: ZLS-018 Rev 5 (P2.4), ZLS-020 (REL2.1 REL3#2.2)
CHEATER MOTOR 2: ZLS-018 Rev 5 (P2.5), ZLS-020 (REL1.2 REL4.1)
NetLabel511: ZLS-018 Rev 5 (P8.9), ZLS-020 (REL1.3 REL2.3)
NetLabel512: ZLS-018 Rev 5 (P8.8), ZLS-020 (REL3#2.3 REL4.3)